# Altium schematic sheet Charger_Schematic.SchDoc
size A2
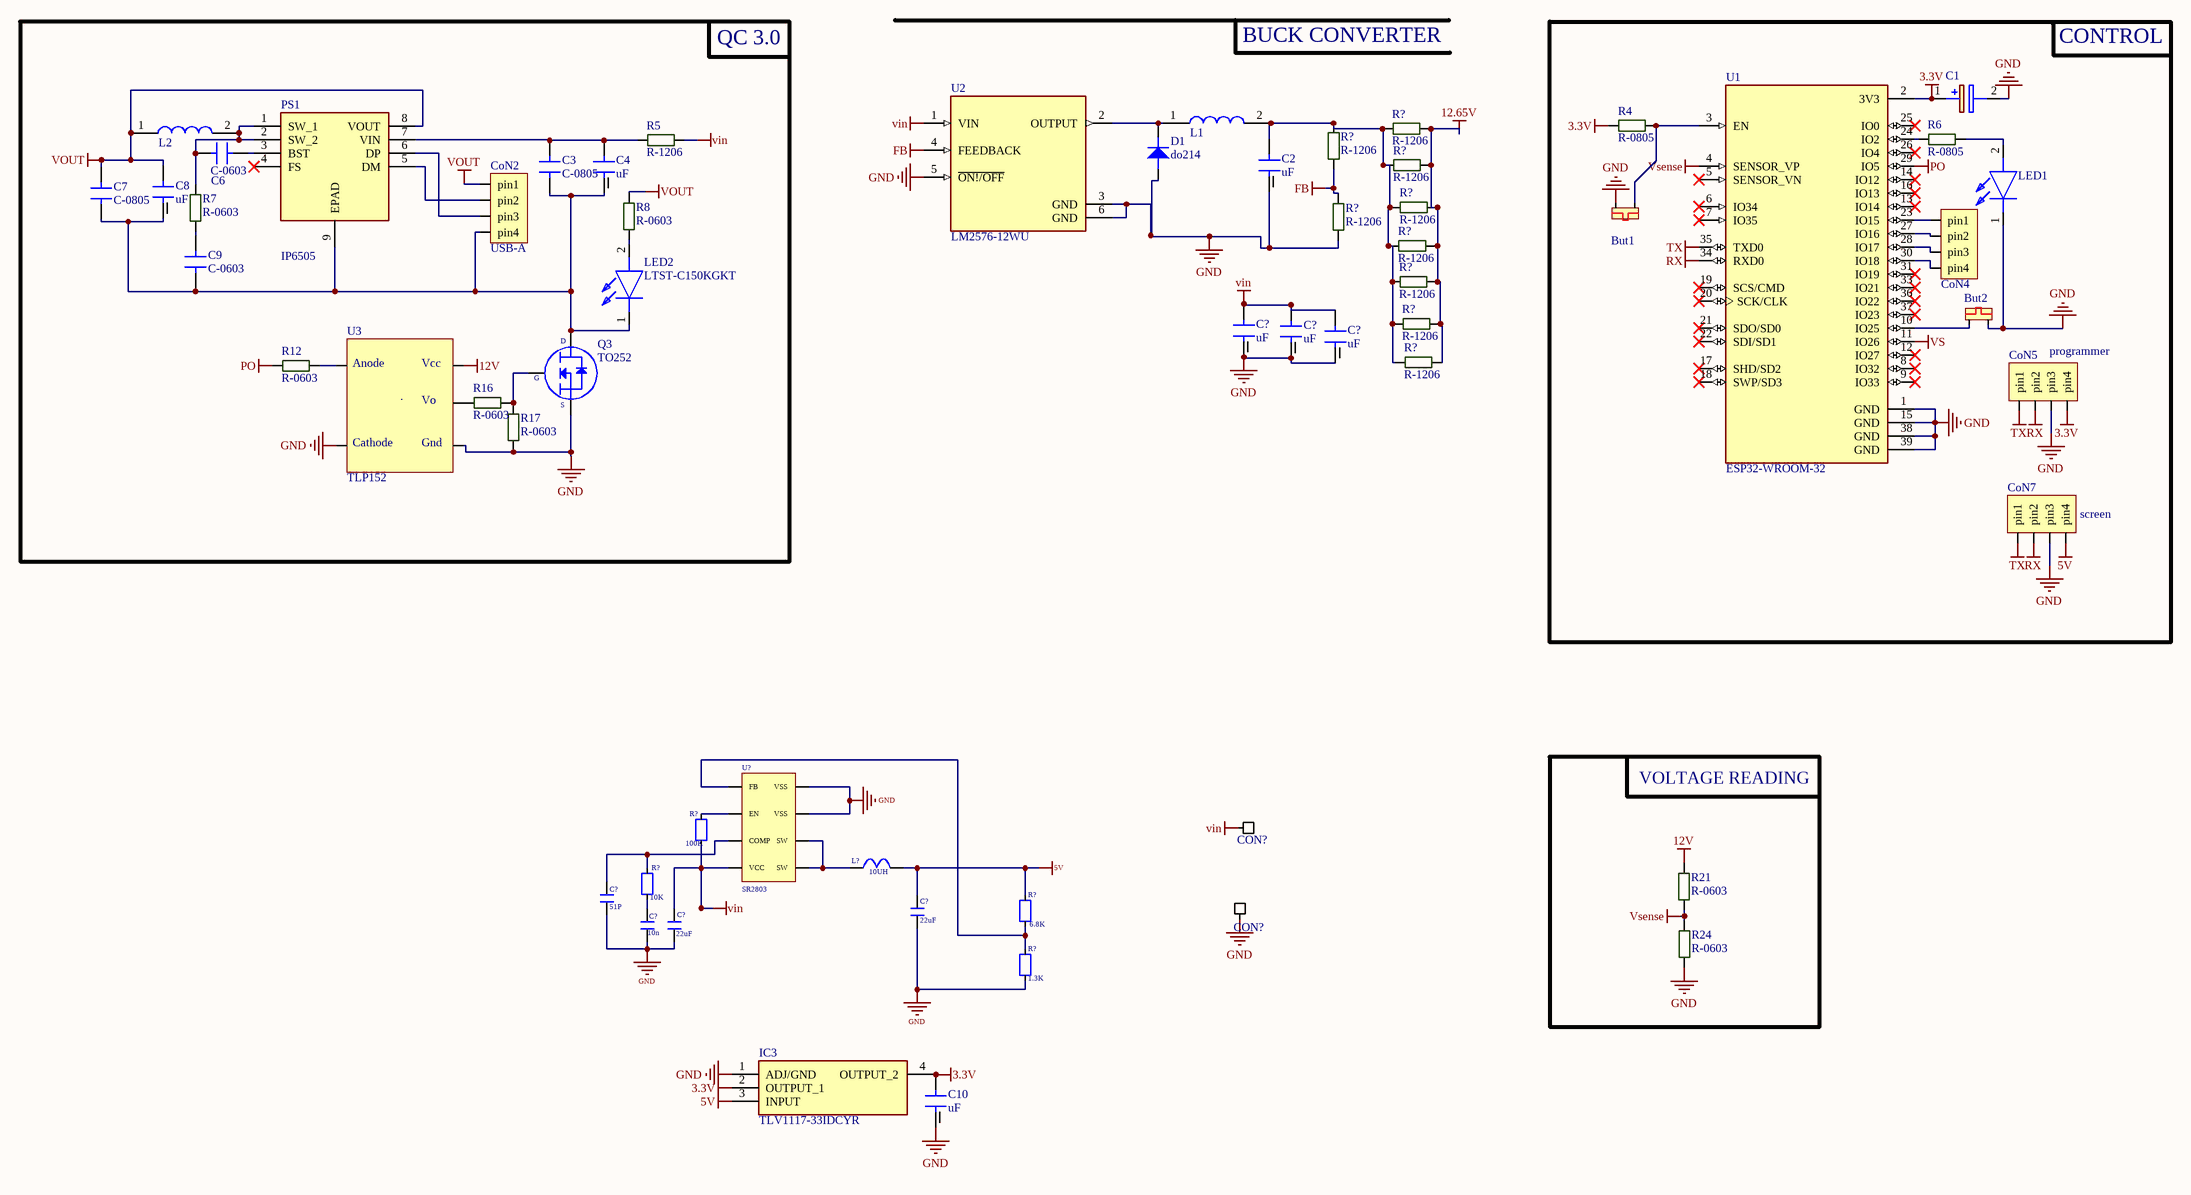
[diagram p0: Charger_Schematic.SchDoc]

## Parts
(Parts that share a designator on the sheet are numbered #1, #2 ... from top to bottom, then left to right.)
But1  BUT  [ButTON]  (value not drawn)
But2  BUT  [ButTON]  (value not drawn)
C1  TAJA104K035KNJ  [CAPPM3216X180N]  (value not drawn)
C2  uF  [CapSmdElc]
C3  C-0805  [C-0805W]
C4  uF  [CapSmdElc]
C6  C-0603  [C-0603W]
C7  C-0805  [C-0805W]
C8  uF  [CapSmdElc]
C9  C-0603  [C-0603W]
C10  uF  [CapSmdElc]
C?#1  uF  [CapSmdElc]
C?#2  uF  [CapSmdElc]
C?#3  uF  [CapSmdElc]
C?#4  51P  [0603 CAPACITOR]
C?#5  22uF  [0603 CAPACITOR]
C?#6  22uF  [0603 CAPACITOR]
C?#7  10n  [0603 CAPACITOR]
CoN2  USB-A  [usb  a]
CoN4  4pinCon  [4pinCon]  (value not drawn)
CoN5  4pinCon  [4pinCon]  (value not drawn)
CoN7  4pinCon  [4pinCon]  (value not drawn)
CON?#1  BATTERY CONNECTOR  [BATTERY CONNECTOR]  (value not drawn)
CON?#2  BATTERY CONNECTOR  [BATTERY CONNECTOR]  (value not drawn)
D1  do214  [DO-214AC]
IC3  TLV1117-33IDCYR  [TLV1117]
L1  inducter_SMPI06050  [inductor]  (value not drawn)
L2  inducter_SMPI06050  [inductor]  (value not drawn)
L?  10UH  [10UH INDUCTOR]
LED1  LTST-C150KGKT  [LED1206]  (value not drawn)
LED2  LTST-C150KGKT  [LED1206]
PS1  IP6505  [IP6505]
Q3  TO252  [TO-252]
R4  R-0805  [R-0805W]
R5  R-1206  [R-1206W]
R6  R-0805  [R-0805W]
R7  R-0603  [R-0603W]
R8  R-0603  [R-0603W]
R12  R-0603  [R-0603W]
R16  R-0603  [R-0603W]
R17  R-0603  [R-0603W]
R21  R-0603  [R-0603W]
R24  R-0603  [R-0603W]
R?#1  R-1206  [R-1206W]
R?#2  R-1206  [R-1206W]
R?#3  R-1206  [R-1206W]
R?#4  R-1206  [R-1206W]
R?#5  R-1206  [R-1206W]
R?#6  R-1206  [R-1206W]
R?#7  R-1206  [R-1206W]
R?#8  R-1206  [R-1206W]
R?#9  R-1206  [R-1206W]
R?#10  100K  [0603 RESISTOR]
R?#11  10K  [0603 RESISTOR]
R?#12  6.8K  [0603 RESISTOR]
R?#13  1.3K  [0603 RESISTOR]
U1  ESP32-WROOM-32  [MODULE_ESP32-WROOM-32]
U2  LM2576-12WU  [TO17P1435X465-6N]
U3  TLP152  [TLP152]
U?  SR2803  [SR2803]

## Blocks framed on the sheet
QC 3.0: C3 C4 C6-C9 CoN2 L2 LED2 PS1 Q3 R5 R7 R8 R12 R16 R17 U3
CONTROL: But1 But2 C1 CoN4 CoN5 CoN7 LED1 R4 R6 U1
VOLTAGE READING: R21 R24

## Nets
3.3V: C1.1(+) C10.1 CoN5.4(pin4) IC3.2(OUTPUT_1) IC3.4(OUTPUT_2) R4.1 U1.2(3V3)
5V: C?#5.2 CoN7.4(pin4) IC3.3(INPUT) L?.2 R?#12.2
12.65V: R?#1.1 R?#3.1 R?#4.1 R?#6.1 R?#7.1 R?#8.1 R?#9.1
12V: R21.2 U3.5
FB: R?#2.2 R?#5.1 U2.4(FEEDBACK)
GND: But1.2 But2.2 C1.2(-) C2.2 C10.2 C?#1.2 C?#2.2 C?#3.2 C?#4.1 C?#5.1 C?#6.1 C?#7.1 CoN5.3(pin3) CoN7.3(pin3) CON?#2.1 D1.a IC3.1(ADJ/GND) LED1.1(K) Q3.3 R17.1 R24.1 R?#5.2 R?#13.1 U1.1(GND) U1.15(GND) U1.38(GND) U1.39(GND) U2.3(GND) U2.5(~{ON!/OFF}) U2.6(GND) U3.2 U3.3 U?.7(VSS) U?.8(VSS)
PO: R12.2 U1.29(IO5)
RX: CoN5.2(pin2) CoN7.2(pin2) U1.34(RXD0)
TX: CoN5.1(pin1) CoN7.1(pin1) U1.35(TXD0)
vin: C?#1.1 C?#2.1 C?#3.1 C?#6.2 CON?#1.1 R5.1 R?#10.1 U2.1(VIN) U?.4(VCC)
VOUT: C7.2 C8.1 CoN2.1(pin1) L2.1 PS1.8(VOUT) R8.2
VS: U1.11(IO26)
Vsense: R21.1 R24.2 U1.4(SENSOR_VP)
NetBut1_1: But1.1 R4.2 U1.3(EN)
NetBut2_1: But2.1 U1.10(IO25)
NetC2_1: C2.1 L1.2 R?#1.2 R?#2.1 R?#3.2 R?#4.2 R?#6.2 R?#7.2 R?#8.2 R?#9.2
NetC3_1: C3.1 C4.2 C7.1 C8.2 C9.1 CoN2.4(pin4) LED2.1(K) PS1.9(EPAD) Q3.4
NetC3_2: C3.2 C4.1 PS1.7(VIN) R5.2
NetC6_1: C6.1 PS1.3(BST)
NetC6_2: C6.2 L2.2 PS1.1(SW_1) PS1.2(SW_2) R7.2
NetC9_2: C9.2 R7.1
NetC?#4_2: C?#4.2 R?#11.2 U?.3(COMP)
NetC?#7_2: C?#7.2 R?#11.1
NetCoN2_2: CoN2.2(pin2) PS1.5(DM)
NetCoN2_3: CoN2.3(pin3) PS1.6(DP)
NetCoN4_1: CoN4.1(pin1) U1.23(IO15)
NetCoN4_2: CoN4.2(pin2) U1.27(IO16)
NetCoN4_3: CoN4.3(pin3) U1.28(IO17)
NetCoN4_4: CoN4.4(pin4) U1.30(IO18)
NetD1_k: D1.k L1.1 U2.2(OUTPUT)
NetL?_1: L?.1 U?.5(SW) U?.6(SW)
NetLED1_2: LED1.2(A) R6.2
NetLED2_2: LED2.2(A) R8.1
NetQ3_1: Q3.1 R16.2 R17.2
NetR6_1: R6.1 U1.24(IO2)
NetR12_1: R12.1 U3.1
NetR16_1: R16.1 U3.4
NetR?#10_2: R?#10.2 U?.2(EN)
NetR?#12_1: R?#12.1 R?#13.2 U?.1(FB)

Not connected (* = marked no-connect by the designer): PS1 4(FS)*; U1 5(SENSOR_VN)* 6(IO34)* 7(IO35)* 8(IO32)* 9(IO33)* 12(IO27)* 13(IO14)* 14(IO12)* 16(IO13)* 17(SHD/SD2)* 18(SWP/SD3)* 19(SCS/CMD)* 20(SCK/CLK)* 21(SDO/SD0)* 22(SDI/SD1)* 25(IO0)* 26(IO4)* 31(IO19)* 33(IO21)* 36(IO22)* 37(IO23)*

## Notes on the sheet
- BUCK CONVERTER
- (near CoN5) programmer
- (near CoN7) screen
- (in symbol TLP152(TPL,E) Anode; Vcc; Vo; Cathode; Gnd
- (in symbol TO252) D; G; S

## Library data of the parts
C1 = TAJA104K035KNJ: Capacitor Polarised; Manufacturer_Name: AVX; Datasheet Link: http://www.farnell.com/datasheets/1680476.pdf; Height: 1.8mm; Manufacturer_Part_Number: TAJA104K035KNJ; Mouser Part Number: 581-TAJA104K035KNJ; Mouser Price/Stock: https://www.mouser.com/Search/Refine.aspx?Keyword=581-TAJA104K035KNJ
C2 C4 C8 C10 C?#1-C?#3 = CAPSMDELC
C?#5 C?#6 = 22UF CAPACITOR
C?#7 = 10n CAPACITOR
D1 = do214: DIODE FAST SWITCHING Single 150mA 75V SMT SOD323
IC3 = TLV1117-33IDCYR: Integrated Circuit; Manufacturer_Name: Texas Instruments; Datasheet Link: http://www.ti.com/lit/ds/symlink/tlv1117-33.pdf; Height: 1.8mm; Manufacturer_Part_Number: TLV1117-33IDCYR; Mouser Part Number: 595-TLV1117-33IDCYR; Mouser Price/Stock: https://www.mouser.co.uk/ProductDetail/Texas-Instruments/TLV1117-33IDCYR?qs=p6lVfQR1GSoKgp3tAXcW5w%3D%3D; Arrow Part Number: TLV1117-33IDCYR; Arrow Price/Stock: https://www.arrow.com/en/products/tlv1117-33idcyr/texas-instruments
L? = 10UH INDUCTOR
LED1 LED2 = LTST-C150KGKT: LED; Manufacturer_Name: Lite-On; Datasheet Link: http://optoelectronics.liteon.com/upload/download/ds22-2000-072/ltst-c150kgkt.pdf; Height: 1.2mm; Manufacturer_Part_Number: LTST-C150KGKT; Mouser Part Number: 859-LTST-C150KGKT; Mouser Price/Stock: https://www.mouser.com/Search/Refine.aspx?Keyword=859-LTST-C150KGKT; RS Part Number: 6920871; RS Price/Stock: https://uk.rs-online.com/web/p/products/6920871
PS1 = IP6505: Power Supply; Manufacturer_Name: INJOINIC; Datasheet Link: https://datasheet.lcsc.com/szlcsc/INJOINIC-IP6505_C188335.pdf; Height: 1.65mm; Manufacturer_Part_Number: IP6505
Q3 = TO252: Manufacturer: Infineon; Manufacturer Part Number: IRF3205STRLPBF; Drain to Source Voltage (Vdss): 55V; Continuous Drain Current (ID): 110A; Rds On Max: 8mR; Input Capacitance: 3.247nF; Max Power Dissipation: 200W; Turn-Off Delay Time: 50ns; Turn-On Delay Time: 14ns; Gate to Source Voltage (Vgs): 20V; Threshold Voltage: 4V; Supplier 1: Digi-Key; RoHS: Yes; Stock 1: 3281; Pricing 1: 1 = 1,84000, 10 = 1,66600, 100 = 1,33840 (USD); Mount: Surface Mount; Case/Package: D2PAK; Number of Pins: 3; Min Operating Temperature: -55°C; Max Operating Temperature: 175°C; Packaging: Cut Tape; Power Dissipation: 200W; Drain to Source Resistance: 8mR; Drain to Source Breakdown Voltage: 55V; Length: 0.42inch; Height: 0.19inch; Width: 0.38inch; REACH SVHC: No SVHC; Lead Free: Lead Free; ComponentLink1URL: https://www.alliedelec.com/m/d/b8827ca43655240244f0cc5c2198e6b1.pdf?src-supplier=Allied+Electronics; ComponentLink1Description: https://www.alliedelec.com/m/d/b8827ca43655240244f0cc5c2198e6b1.pdf?src-supplier=Allied+Electronics; ComponentLink2URL: https://www.infineon.com/dgdl/irf3205spbf.pdf?fileId=5546d462533600a4015355defac9190c&src-supplier=Digi-Key; ComponentLink2Description: https://www.infineon.com/dgdl/irf3205spbf.pdf?fileId=5546d462533600a4015355defac9190c&src-supplier=Digi-Key; ComponentLink3URL: http://www.infineon.com/dgdl/irf3205spbf.pdf?fileId=5546d462533600a4015355defac9190c&src-supplier=Digi-Key; ComponentLink3Description: http://www.infineon.com/dgdl/irf3205spbf.pdf?fileId=5546d462533600a4015355defac9190c&src-supplier=Digi-Key; ComponentLink4URL: http://www.farnell.com/datasheets/1884183.pdf?src-supplier=Element14; ComponentLink4Description: http://www.farnell.com/datasheets/1884183.pdf?src-supplier=Element14; Supplier Part Number 1: IRF3205STRLPBFCT-ND
R?#10 = 100K RESISTOR
R?#12 = 6.8K RESISTOR
U1 = ESP32-WROOM-32: Bluetooth, WiFi Transceiver Module 2.4GHz ~ 2.5GHz Surface Mount; MF: Espressif Systems; Package: Module Espressif Systems; Digi-Key_Part_Number: 1904-1010-1-ND; Digi-Key_Purchase_URL: https://www.digikey.com/product-detail/en/espressif-systems/ESP32-WROOM-32/1904-1010-1-ND/8544305?utm_source=snapeda&utm_medium=aggregator&utm_campaign=symbol; Value: *; MP: ESP32-WROOM-32; SnapEDA_Link: https://www.snapeda.com/parts/ESP32-WROOM-32/Espressif%20Systems/view-part/2753322/?ref=snap
U2 = LM2576-12WU: Buck Switching Regulator IC Positive Fixed 12V 1 Output 3A TO-263-6, DÂ²Pak _5 Leads + Tab_, TO-263BA; MF: Microchip; Package: TO-263-5 Microchip; MP: LM2576-12WU; Value: *; SnapEDA_Link: https://www.snapeda.com/parts/LM2576-12WU/Microchip/view-part/2873733/?ref=snap; Price: None; Availability: Unavailable
U3 = TLP152(TPL,E: OPTOISO 3.75KV GATE DRIVER 6SO-5; Manufacturer: Toshiba; Number of Channels: 1; Propagation Delay: 165ns; Max Power Dissipation: 260mW; Direction: Unidirectional; Turn-On Delay Time: 190ns; Fall Time: 22ns; Forward Voltage: 1.57V; Output Current: 2.5A; Forward Current: 10mA; Rise Time: 18ns; High Level Output Current: 2A; Pulse Width Distortion (PWD): 50ns; Supplier 1: Mouser; Manufacturer Part Number: TLP152(TPL,E; RoHS: Yes; Stock 1: 22321; Pricing 1: 1 = 1.55000, 10 = 0.96800, 50 = 0.96800, 100 = 0.87200, 1000 = 0.54300, 10000 = 0.44000 (USD); Mount: Surface Mount; Case/Package: SO; Number of Pins: 5; Min Operating Temperature: -40°C; Max Operating Temperature: 100°C; Packaging: Tape and Reel; Package Quantity: 3000; Low Level Output Current: 2A; Max Output Current: 2.5A; ComponentLink1URL: https://datasheet.ciiva.com/41848/tlp152-datasheet-en-20120914-41848928.pdf?src-supplier=Digi-Key; ComponentLink1Description: https://datasheet.ciiva.com/41848/tlp152-datasheet-en-20120914-41848928.pdf?src-supplier=Digi-Key; Supplier Part Number 1: 757-TLP152TPLE
U? = SR2803 VOLTAJ REG.